# EAGLE design roaster3 (EAGLE 9.6.2)
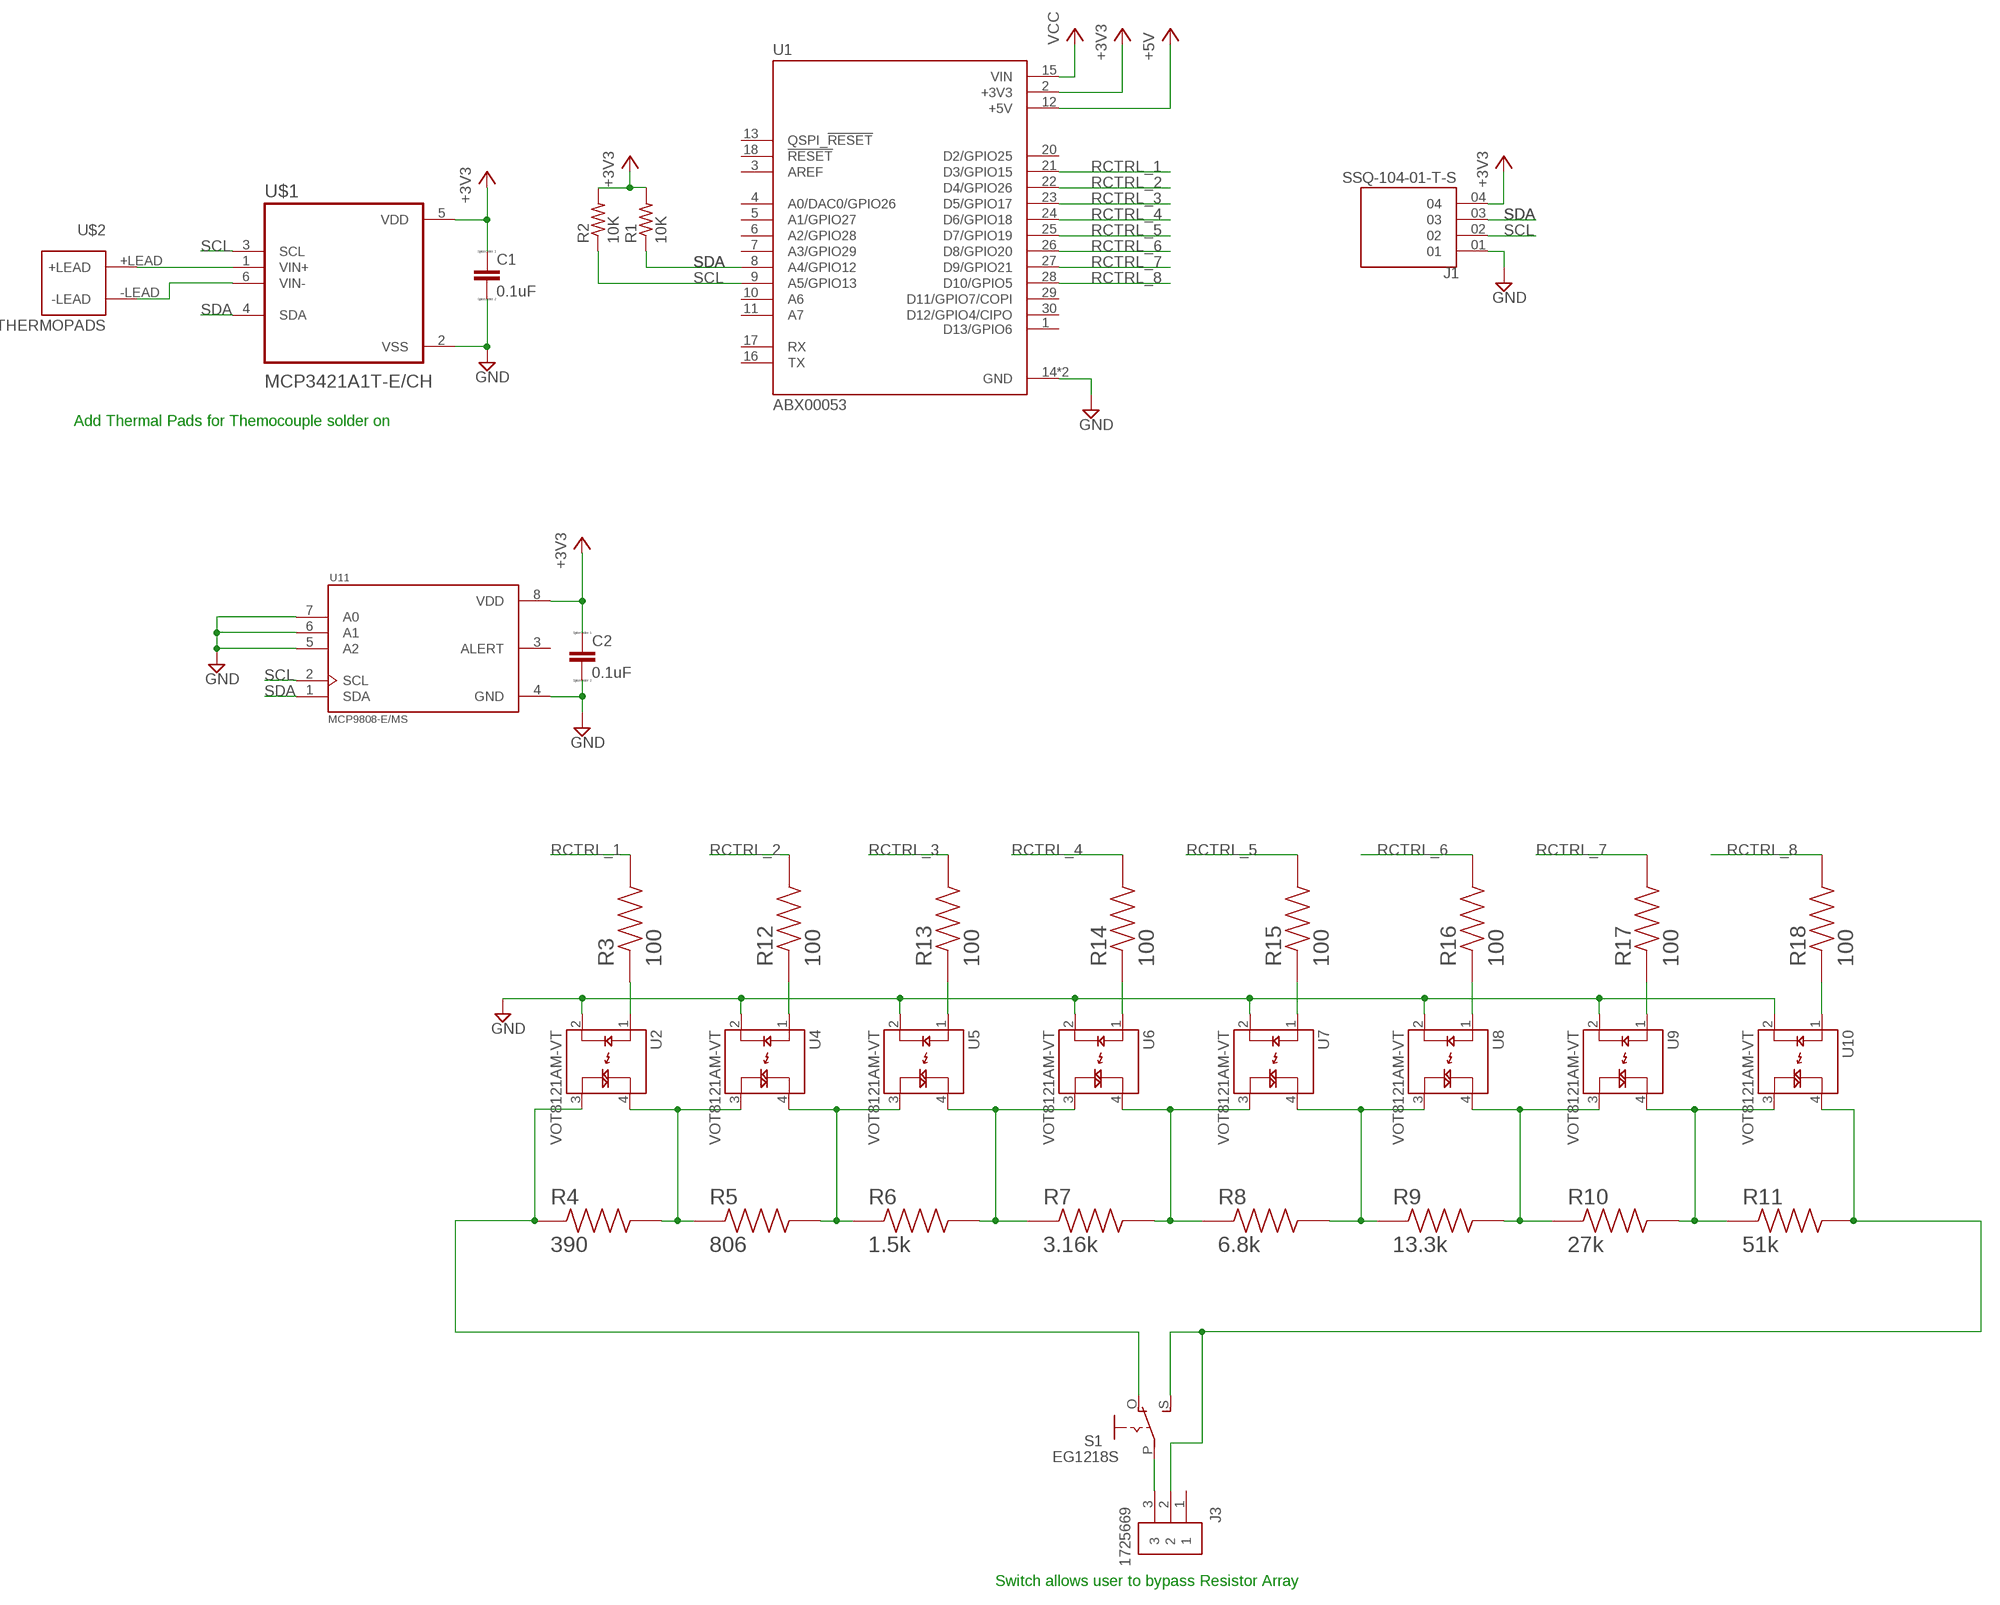
[diagram p0: schematic, sheet 1]

## Parts
C1  0.1uF  RUNJUMP_CAPACITOR-0.1UF-DECOUPLING-0603  [RUNJUMP_C0603]
C2  0.1uF  RUNJUMP_CAPACITOR-0.1UF-DECOUPLING-0603  [RUNJUMP_C0603]
J1  SSQ-104-01-T-S  [SAMTEC_SSQ-104-01-T-S]
J3  1725669  [PHOENIX_1725669]
R1  10K  RUNJUMP_RESISTOR-10K  [RUNJUMP_R0603]
R2  10K  RUNJUMP_RESISTOR-10K  [RUNJUMP_R0603]
R3  100  AC0603FR-10100RL  [RESC1608X55N]
R4  390  RMCF2512JT390R  [RESC6332X70N]
R5  806  RMCF2512FT806R  [RESC6332X70N]
R6  1.5k  RMCF2512JT1K50  [RESC6332X70N]
R7  3.16k  RMCF2512FT3K16  [RESC6332X70N]
R8  6.8k  RMCF2512JT6K80  [RESC6332X70N]
R9  13.3k  RMCF2512FT13K3  [RESC6332X70N]
R10  27k  RMCF2512JT27K0  [RESC6332X70N]
R11  51k  RMCF2512JT51K0  [RESC6332X70N]
R12  100  AC0603FR-10100RL  [RESC1608X55N]
R13  100  AC0603FR-10100RL  [RESC1608X55N]
R14  100  AC0603FR-10100RL  [RESC1608X55N]
R15  100  AC0603FR-10100RL  [RESC1608X55N]
R16  100  AC0603FR-10100RL  [RESC1608X55N]
R17  100  AC0603FR-10100RL  [RESC1608X55N]
R18  100  AC0603FR-10100RL  [RESC1608X55N]
S1  EG1218S  [EG1218]
U1  ABX00053  [MODULE_ABX00053]
U2  VOT8121AM-VT  [SOIC254P675X240-4N]
U4  VOT8121AM-VT  [SOIC254P675X240-4N]
U5  VOT8121AM-VT  [SOIC254P675X240-4N]
U6  VOT8121AM-VT  [SOIC254P675X240-4N]
U7  VOT8121AM-VT  [SOIC254P675X240-4N]
U8  VOT8121AM-VT  [SOIC254P675X240-4N]
U9  VOT8121AM-VT  [SOIC254P675X240-4N]
U10  VOT8121AM-VT  [SOIC254P675X240-4N]
U11  MCP9808-E/MS  [SOP65P490X110-8N]
U$1  MCP3421A1T-E/CH  [SOT95P280X145-6N]
U$2  THERMOPADS  [THERMOPADS]

## Nets
+3V3: C1.1 C2.1 J1.04 R1.2 R2.2 U1.2(+3V3) U11.8(VDD) U$1.5(VDD)
+5V: U1.12(+5V)
GND: C1.2 C2.2 J1.01 U1.14(GND) U1.19(GND) U2.2(C) U4.2(C) U5.2(C) U6.2(C) U7.2(C) U8.2(C) U9.2(C) U10.2(C) U11.4(GND) U11.5(A2) U11.6(A1) U11.7(A0) U$1.2(VSS)
N$1: J3.3 S1.P
N$2: U$1.6(VIN-) U$2.-LEAD
N$3: U$1.1(VIN+) U$2.+LEAD
N$4: R5.2 R6.1 U4.4(MT2) U5.3(MT1)
N$5: R4.1 S1.O U2.3(MT1)
N$6: R4.2 R5.1 U2.4(MT2) U4.3(MT1)
N$7: J3.2 R11.2 S1.S U10.4(MT2)
N$8: R6.2 R7.1 U5.4(MT2) U6.3(MT1)
N$9: R7.2 R8.1 U6.4(MT2) U7.3(MT1)
N$10: R8.2 R9.1 U7.4(MT2) U8.3(MT1)
N$11: R9.2 R10.1 U8.4(MT2) U9.3(MT1)
N$12: R10.2 R11.1 U9.4(MT2) U10.3(MT1)
N$13: R3.1 U2.1(A)
N$14: R12.1 U4.1(A)
N$15: R13.1 U5.1(A)
N$16: R14.1 U6.1(A)
N$17: R15.1 U7.1(A)
N$18: R16.1 U8.1(A)
N$19: R17.1 U9.1(A)
N$20: R18.1 U10.1(A)
RCTRL_1: R3.2 U1.21(D3/GPIO15)
RCTRL_2: R12.2 U1.22(D4/GPIO26)
RCTRL_3: R13.2 U1.23(D5/GPIO17)
RCTRL_4: R14.2 U1.24(D6/GPIO18)
RCTRL_5: R15.2 U1.25(D7/GPIO19)
RCTRL_6: R16.2 U1.26(D8/GPIO20)
RCTRL_7: R17.2 U1.27(D9/GPIO21)
RCTRL_8: R18.2 U1.28(D10/GPIO5)
SCL: J1.02 R2.1 U1.9(A5/GPIO13) U11.2(SCL) U$1.3(SCL)
SDA: J1.03 R1.1 U1.8(A4/GPIO12) U11.1(SDA) U$1.4(SDA)
VCC: U1.15(VIN)
Unconnected: J3.1 U1.1(D13/GPIO6) U1.3(AREF) U1.4(A0/DAC0/GPIO26) U1.5(A1/GPIO27) U1.6(A2/GPIO28) U1.7(A3/GPIO29) U1.10(A6) U1.11(A7) U1.13(QSPI_!RESET) U1.16(TX) U1.17(RX) U1.18(!RESET) U1.20(D2/GPIO25) U1.29(D11/GPIO7/COPI) U1.30(D12/GPIO4/CIPO) U11.3(ALERT)

## Notes on the sheet
- Add Thermal Pads for Themocouple solder on
- Switch allows user to bypass Resistor Array

## Library data of the parts
C1 C2 = 2Cortico-Gen-2-Board-v1.0:RUNJUMP_CAPACITOR: Capacitor 0805; MFR: Samsung Electro-Mechanics; MFR_PN: CL10A104KA8NNNC; PN_DIGIKEY: 1276-1857-1-ND; URL_DIGIKEY: https://www.digikey.com/product-detail/en/samsung-electro-mechanics/CL10A104KA8NNNC/1276-1857-1-ND/3889943; VOLTAGE: 25V
J1 = roasterControl:SSQ-104-01-T-S: Check availability <https://pricing.snapeda.com/parts/SSQ-104-01-T-S/Samtec%20Inc./view-part?ref=eda>; AVAILABILITY: In Stock; DESCRIPTION: SSQ - Samtec 2.54mm Square Tail Single Row Socket Strip 8.5mm Profile - Fast Stock; DIGIKEY_PN: SSQ-104-01-T-S; MF: Samtec Inc.; MP: SSQ-104-01-T-S; PACKAGE: None; PRICE: None; PURCHASE-URL: https://pricing.snapeda.com/search/part/SSQ-104-01-T-S/?ref=eda
J3 = roasterControl:1725669: 3 Position Wire to Board Terminal Block Horizontal with Board 0.100" (2.54mm) Through Hole Check availability <https://pricing.snapeda.com/parts/1725669/Phoenix%20Contact/view-part?ref=eda>; AVAILABILITY: In Stock; DESCRIPTION: 3 Position Wire to Board Terminal Block Horizontal with Board 0.100 (2.54mm) Through Hole; DIGIKEY_PN: 1725669; MF: Phoenix Contact; MP: 1725669; PACKAGE: None; PRICE: None; PURCHASE-URL: https://pricing.snapeda.com/search/part/1725669/?ref=eda
R1 R2 = 2Cortico-Gen-2-Board-v1.0:RUNJUMP_RESISTOR; MFR: Samsung Electro-Mechanics; MFR_PN: RC1608J103CS; PN_DIGIKEY: 1276-5086-1-ND; TOLERANCE: 5%; URL_DIGIKEY: https://www.digikey.com/product-detail/en/samsung-electro-mechanics/RC1608J103CS/1276-5086-1-ND/3968058
R3 R12-R18 = AC0603FR-10100RL:AC0603FR-10100RL: RES SMD 1.6M OHM 5% 1/10W 0603 Check availability <https://pricing.snapeda.com/parts/AC0603FR-10100RL/Yageo/view-part?ref=eda>; AVAILABILITY: In Stock; DESCRIPTION: 100 Ohms ±1% 0.1W, 1/10W Chip Resistor 0603 (1608 Metric) Automotive AEC-Q200 Thick Film; DIGIKEY_PN: AC0603FR-10100RL; MF: Yageo; MP: AC0603FR-10100RL; PACKAGE: None; PRICE: None; PURCHASE-URL: https://pricing.snapeda.com/search/part/AC0603FR-10100RL/?ref=eda
R4 = RMCF2512JT390R:RMCF2512JT390R: Check availability <https://pricing.snapeda.com/parts/RMCF2512JT390R/Stackpole%20Electronics%20Inc/view-part?ref=eda>; AVAILABILITY: In Stock; DESCRIPTION: 390 Ohms ±5% 1W Chip Resistor 2512 (6432 Metric) Automotive AEC-Q200 Thick Film; DIGIKEY_PN: RMCF2512JT390RCT-ND; MF: Stackpole Electronics Inc; MP: RMCF2512JT390R; PACKAGE: 6332 Stackpole; PRICE: None; PURCHASE-URL: https://pricing.snapeda.com/search/part/RMCF2512JT390R/?ref=eda
R5 = RMCF2512JT390R:RMCF2512FT806R; DIGIKEY_PN: RMCF2512FT806RCT-ND
R6 = RMCF2512JT390R:RMCF2512JT1K50: Check availability <https://pricing.snapeda.com/parts/RMCF2512JT390R/Stackpole%20Electronics%20Inc/view-part?ref=eda>; DESCRIPTION: 1.5k ohms; DIGIKEY_PN: RMCF2512JT1K50; MF: Stackpole Electronics Inc
R7 = RMCF2512JT390R:RMCF2512FT3K16: Check availability <https://pricing.snapeda.com/parts/RMCF2512JT390R/Stackpole%20Electronics%20Inc/view-part?ref=eda>; DESCRIPTION: 3.16kOhms; DIGIKEY_PN: RMCF2512FT3K16; MF: Stackpole Electronics Inc
R8 = RMCF2512JT390R:RMCF2512JT6K80: Check availability <https://pricing.snapeda.com/parts/RMCF2512JT390R/Stackpole%20Electronics%20Inc/view-part?ref=eda>; DESCRIPTION: 6.8kOhms; DIGIKEY_PN: RMCF2512JT6K80; MF: Stackpole Electronics Inc
R9 = RMCF2512JT390R:RMCF2512FT13K3: Check availability <https://pricing.snapeda.com/parts/RMCF2512JT390R/Stackpole%20Electronics%20Inc/view-part?ref=eda>; DESCRIPTION: 13.3kOhms; DIGIKEY_PN: RMCF2512FT13K3; MF: Stackpole Electronics Inc
R10 = RMCF2512JT390R:RMCF2512JT27K0: Check availability <https://pricing.snapeda.com/parts/RMCF2512JT390R/Stackpole%20Electronics%20Inc/view-part?ref=eda>; DESCRIPTION: 27kOhms; DIGIKEY_PN: RMCF2512JT27K0; MF: Stackpole Electronics Inc
R11 = RMCF2512JT390R:RMCF2512JT51K0: Check availability <https://pricing.snapeda.com/parts/RMCF2512JT390R/Stackpole%20Electronics%20Inc/view-part?ref=eda>; DESCRIPTION: 51kohms; DIGIKEY_PN: RMCF2512JT51K0; MF: Stackpole Electronics Inc
S1 = EG1218:EG1218: SLIDING SWITCH 0.1" spacing through hole, vertical SPDT slide switch http://www.ladyada.net/library/pcb/eaglelibrary.html Check availability <https://pricing.snapeda.com/parts/EG1218./E-Switch/view-part?ref=eda>; AVAILABILITY: In Stock; DESCRIPTION: SLIDE SWITCH, SPDT, 200MA; Contact Configuration:SPDT; Switch Operation:-; Switch Mounting:Through Hole; Product Range:-; Contact Current Max:-; Contact Voltage AC Max:-; Contact Voltage DC Max:-; Orientation:Vertical; DIGIKEY_PN: EG1218.; MF: E-Switch; MP: EG1218.; PACKAGE: None; PRICE: None
U1 = roasterControl:ABX00053: ARDUINO NANO RP2040 CONNECT WITH; DESCRIPTION: NINA-W102, RP2040 Arduino Nano RP2040 Connect with Headers series ARM® Cortex®-M0+ MCU 32-Bit Embedded Evaluation Board; DIGI-KEY_PART_NUMBER: 1050-ABX00053-ND; MF: Arduino; MP: ABX00053; PACKAGE: None; PURCHASE-URL: https://pricing.snapeda.com/search/part/ABX00053/?ref=eda
U2 U4-U10 = VOT8121AM-VT:VOT8121AM-VT: VOT8121AM-VT Check availability <https://pricing.snapeda.com/parts/VOT8121AM-VT/Vishay%20Semiconductor%20Opto%20Division/view-part?ref=eda>; AVAILABILITY: In Stock; DESCRIPTION: Optoisolator Triac Output 3750Vrms 1 Channel 4-SOP; DIGIKEY_PN: VOT8121AM-VT; MF: Vishay Semiconductor Opto Division; MP: VOT8121AM-VT; PACKAGE: SMD-4 Vishay Semiconductor Opto Division; PRICE: None; PURCHASE-URL: https://pricing.snapeda.com/search/part/VOT8121AM-VT/?ref=eda
U11 = MCP9808-E_MS:MCP9808-E/MS: Board Mount Temperature Sensors Silicon temp sensor with I2C interface Check availability <https://pricing.snapeda.com/parts/MCP9808-E/MS/Microchip/view-part?ref=eda>; AVAILABILITY: In Stock; DESCRIPTION: Temperature Sensor Digital, Local -40°C ~ 125°C 12 b 8-MSOP; DIGIKEY_PN: MCP9808-E/MS; MF: Microchip; MP: MCP9808-E/MS; PACKAGE: MSOP-8 Microchip; PRICE: None; PURCHASE-URL: https://pricing.snapeda.com/search/part/MCP9808-E/MS/?ref=eda
U$1 = MCP3421A1T-E_CH:MCP3421A1T-E/CH: Check availability <https://pricing.snapeda.com/parts/MCP3421A1T-E/CH/Microchip%20Technology/view-part?ref=eda>; AVAILABILITY: In Stock; DESCRIPTION: 18 Bit Analog to Digital Converter 1 Input 1 Sigma-Delta SOT-23-6; DIGIKEY_PN: MCP3421A1T-E/CH; MF: Microchip Technology; MP: MCP3421A1T-E/CH; PACKAGE: SOT-23-6 Microchip; PRICE: None; PURCHASE-URL: https://pricing.snapeda.com/search/part/MCP3421A1T-E/CH/?ref=eda
U$2 = roasterControl:THERMOPADS

## Board
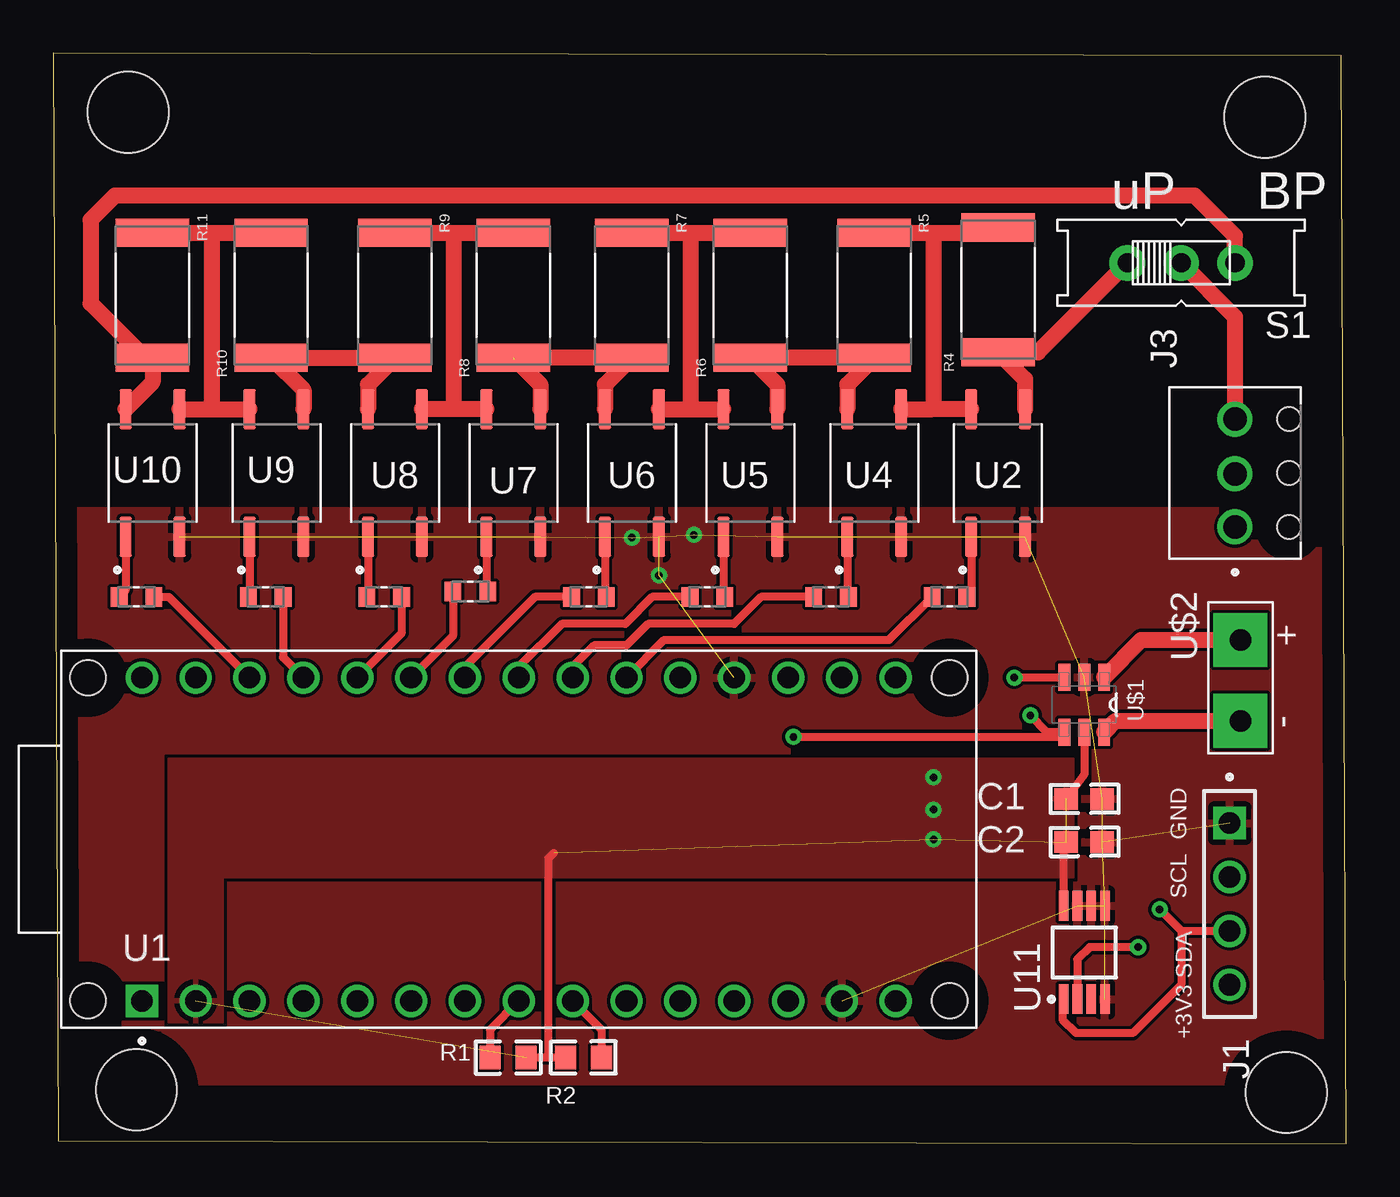
[diagram p1: board, top side]
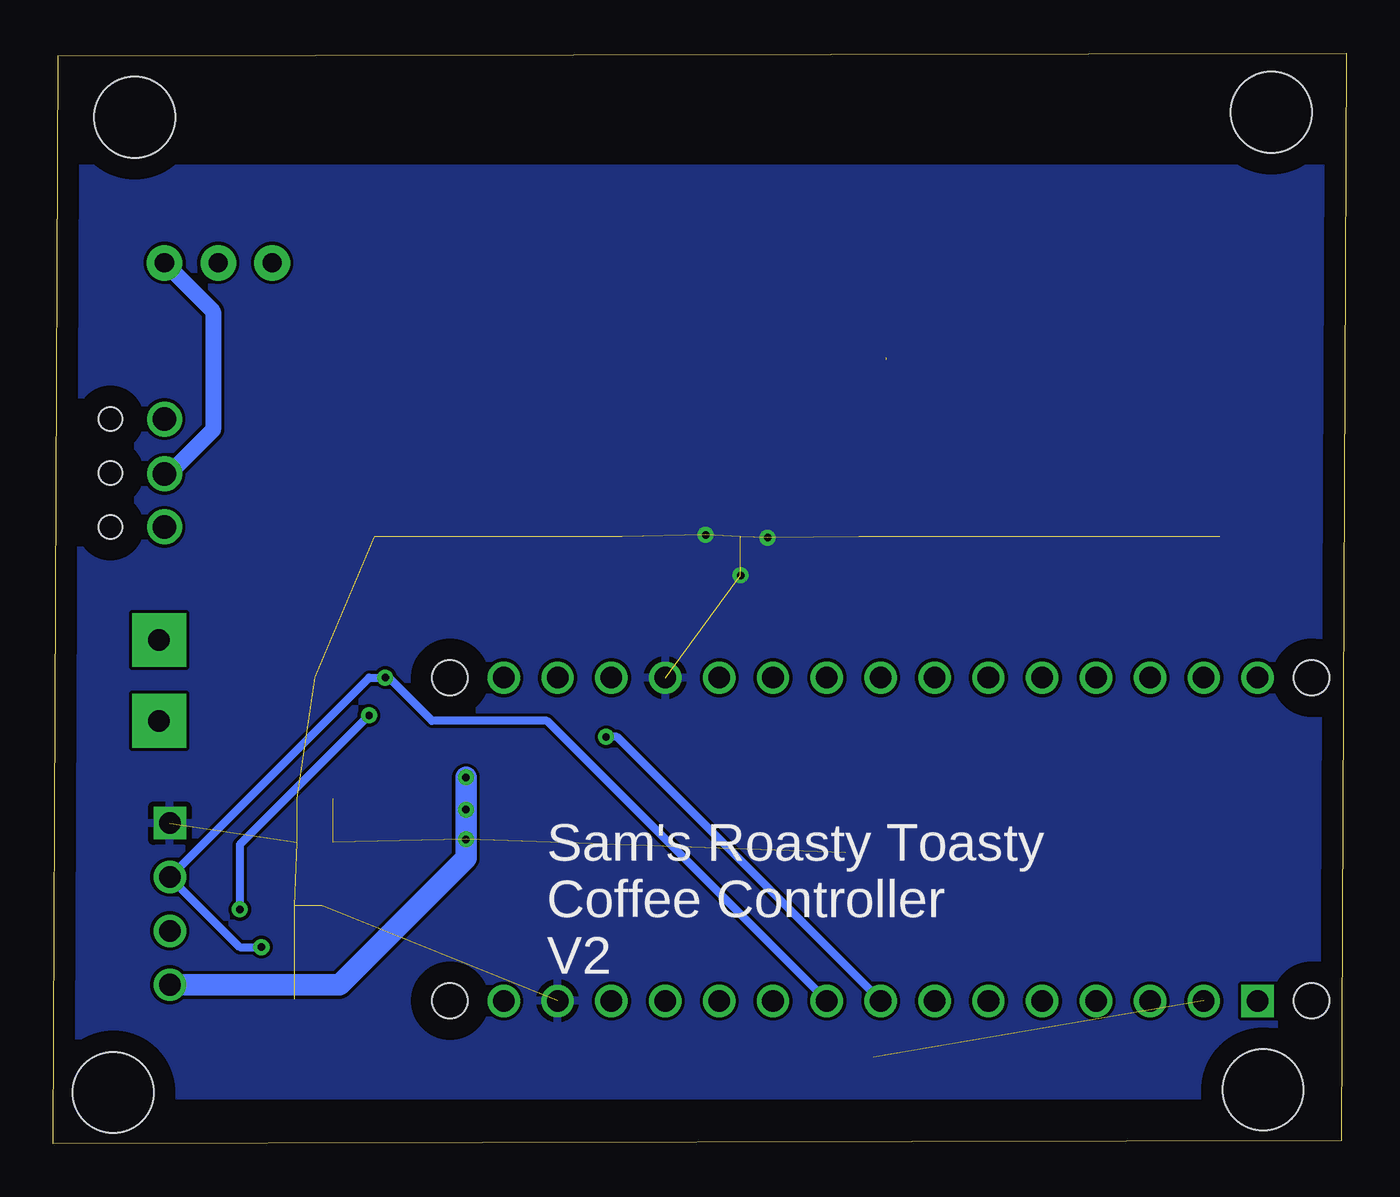
[diagram p2: board, bottom side, seen from below]

Size 61.01 x 51.43 mm. Coordinates in mm from the lower left corner, seen from the top.
Outline: 0.25,0.13 61.01,0 60.76,51.3 0,51.43 0.25,0.13
Copper layers (1*16): Top 0.035mm / dielectric 1.5mm / Bottom 0.035mm
Design rules "default": minimum track width 6mil, minimum drill 0.35mm, track to track 6mil, track to pad 6mil, pad to pad 6mil, via to via 6mil, smd to smd 6mil, copper to edge 40mil, drill to drill 6mil, minimum pad ring 10mil, minimum via ring 8mil, stop-mask expansion 4mil, vias tented up to drill 0mil, thermal gap 10mil
Holes 3.81 mm at 3.94,2.54 58.17,2.41 57.15,48.39 3.56,48.64

### Footprints (pad centres in the part's own frame; a part is rotated, then mirrored left to right if it is on the bottom)
RUNJUMP_C0603 = smd 1.1 x 1: 1 -0.85,0; 2 0.85,0
SAMTEC_SSQ-104-01-T-S = drill 1.02 pad 1.37 square: 01 -3.81,0 | drill 1.02 pad 1.37: 02 -1.27,0; 03 1.27,0; 04 3.81,0
PHOENIX_1725669 = drill 1.1: 1 -2.54,0; 2 -0.04,0; 3 2.54,0 | hole 1.1: -2.54,-2.54; 0,-2.54; 2.54,-2.54
RUNJUMP_R0603 = smd 1 x 1.1: 1 -0.85,0; 2 0.85,0
RESC1608X55N = smd 0.79 x 0.93: 1 -0.82,0; 2 0.82,0
RESC6332X70N = smd 1.33 x 3.46: 1 -2.944,0; 2 2.944,0
EG1218 = drill 0.9 pad 1.676: O -2.54,0; P 0,0; S 2.54,0
MODULE_ABX00053 = drill 1.016 square: 1 -17.78,-7.62 | drill 1.016: 2 -15.24,-7.62; 3 -12.7,-7.62; 4 -10.16,-7.62; 5 -7.62,-7.62; 6 -5.08,-7.62; 7 -2.54,-7.62; 8 0,-7.62; 9 2.54,-7.62; 10 5.08,-7.62; 11 7.62,-7.62; 12 10.16,-7.62; 13 12.7,-7.62; 14 15.24,-7.62; 15 17.78,-7.62; 16 17.78,7.62; 17 15.24,7.62; 18 12.7,7.62; 19 10.16,7.62; 20 7.62,7.62; 21 5.08,7.62; 22 2.54,7.62; 23 0,7.62; 24 -2.54,7.62; 25 -5.08,7.62; 26 -7.62,7.62; 27 -10.16,7.62; 28 -12.7,7.62; 29 -15.24,7.62; 30 -17.78,7.62 | hole 1.65: -20.32,-7.62; -20.32,7.62; 20.32,7.62; 20.32,-7.62
SOIC254P675X240-4N = smd 1.89 x 0.59: 1 -3.01,1.27; 2 -3.01,-1.27; 3 3.01,-1.27; 4 3.01,1.27
SOP65P490X110-8N = smd 1.4 x 0.45: 1 -2.2,0.975; 2 -2.2,0.325; 3 -2.2,-0.325; 4 -2.2,-0.975; 5 2.2,-0.975; 6 2.2,-0.325; 7 2.2,0.325; 8 2.2,0.975
SOT95P280X145-6N = smd 1.27 x 0.559: 1 -1.295,0.94; 2 -1.295,0; 3 -1.295,-0.94; 4 1.295,-0.94; 5 1.295,0; 6 1.295,0.94
THERMOPADS = drill 1.016 pad 2.54 square: +LEAD -1.27,0; -LEAD 2.54,0

### Placement (x,y rotation side)
C1  48.64,16.26 0 top
C2  48.64,14.22 0 top
J1  55.5,11.3 270 top
J3  55.75,31.62 90 top
R1  21.46,4.06 0 top
R2  25.02,4.06 180 top
R3  42.29,25.78 180 top
R4  44.58,40.26 90 top
R5  38.73,40.01 270 top
R6  32.89,40.01 90 top
R7  27.3,40.01 270 top
R8  21.72,40.01 90 top
R9  16.13,40.01 270 top
R10  10.29,40.01 90 top
R11  4.7,40.01 270 top
R12  36.7,25.78 180 top
R13  30.86,25.78 180 top
R14  25.27,25.78 180 top
R15  19.69,26.04 180 top
R16  15.62,25.78 0 top
R17  10.03,25.78 0 top
R18  3.94,25.78 0 top
S1  53.21,41.53 0 top
U1  21.97,14.35 0 top
U2  44.58,31.62 90 top
U4  38.73,31.62 90 top
U5  32.89,31.62 90 top
U6  27.3,31.62 90 top
U7  21.72,31.62 90 top
U8  16.13,31.62 90 top
U9  10.54,31.62 90 top
U10  4.7,31.62 90 top
U11  48.64,9.02 90 top
U$1  48.64,20.7 270 top
U$2  56.01,22.48 270 top

### Tracks (layer width: path | path; a pad name or v marks a point on that pad's centre or on a via)
+3V3  (via drill 0.35)  (4 unrouted)
  Top 0.381: U$1.5 48.64,17.4 C1.1 | C2.1 47.67,13.99 U11.8 | R1.2 23.37,4.06 | 23.37,4.06 R2.2 | 23.37,4.06 23.37,13.46 23.62,13.72
  Bottom 1.016: J1.04 47.5,7.49 41.53,13.46 v41.53,14.35 v41.53,15.75 v41.53,17.27
  pour Top: 5.46,5.71 5.46,18.16 48.13,18.16 48.13,12.57 8,12.57 8,5.71
GND  (via drill 0.35)  (20 unrouted)
  other vias: 30.23,28.7 28.58,26.8 27.3,28.57
  pour Top (rank 2): 0.51,29.84 59.94,29.84 59.94,2.92 0.64,2.92 0.51,2.79
  pour Bottom: 0.64,45.97 60.2,45.97 60.32,45.85 60.32,2.41 60.2,2.29 0.76,2.29 0.64,2.16
N$1
  Top 0.762: S1.P 55.75,38.99 J3.3
N$2
  Top 0.762: U$1.6 50.11,19.94 U$2.-LEAD
N$3
  Top 0.762: U$1.1 51.33,23.75 U$2.+LEAD
N$4
  Top 0.762: U5.3 34.16,35.79 R6.1 R5.2 37.46,35.79 U4.4
N$5
  Top 0.762: U2.3 45.85,36.05 R4.1 46.46,37.32 S1.O
N$6
  Top 0.762: R5.1 41.53,42.95 | 41.53,42.95 44.32,42.95 R4.2 | 41.53,42.95 41.53,34.67 | 41.53,34.67 41.49,34.63 U4.3 | U2.4 41.57,34.63 41.53,34.67
N$7
  Top 0.762: R11.2 4.7,36.7 | 4.7,36.7 4.7,35.9 U10.4 | 4.7,36.7 1.78,39.62 1.78,43.56 2.92,44.7 53.85,44.7 55.75,42.8 S1.S
  Bottom 0.762: S1.S 53.47,39.24 53.47,33.66 55.54,31.58 J3.2
N$8
  Top 0.762: R7.1 30.1,42.95 | 30.1,42.95 R6.2 | U6.3 30.1,34.63 | 30.1,34.63 U5.4 | 30.1,34.63 30.1,42.95
N$9  (1 unrouted)
  Top 0.762: R7.2 27.2,36.96 | 21.72,36.96 20.7,36.96 | R7.2 26.04,35.79 U6.4 | U7.3 22.99,35.79 R8.1 21.74,37.08 27.3,37.08 R7.2
N$10
  Top 0.762: R9.1 18.92,42.95 | 18.92,42.95 R8.2 | U7.4 18.92,34.63 | 18.92,34.63 U8.3 | 18.92,34.63 18.92,42.95
N$11
  Top 0.762: U8.4 14.86,35.79 R9.2 R10.1 11.81,35.54 U9.3
N$12
  Top 0.762: R11.1 7.49,42.95 | 7.49,42.95 R10.2 | U10.3 7.24,34.63 | 7.24,34.63 U9.4 | 7.49,42.95 7.49,34.89 7.24,34.63
N$13
  Top 0.381: U2.1 43.31,25.98 R3.1
N$14
  Top 0.381: U4.1 37.46,25.84 R12.1
N$15
  Top 0.381: U5.1 31.62,25.84 R13.1
N$16
  Top 0.381: U6.1 26.04,25.84 R14.1
N$17
  Top 0.381: U7.1 20.45,26.09 R15.1
N$18
  Top 0.381: U8.1 14.86,25.84 R16.1
N$19
  Top 0.381: U9.1 9.27,25.84 R17.1
N$20
  Top 0.381: U10.1 3.43,26.09 R18.1
RCTRL_1
  Top 0.381: U1.21 28.83,23.75 39.44,23.75 R3.2
RCTRL_2
  Top 0.381: R12.2 33.4,25.78 32.13,24.51 28.07,24.51 27.05,23.49 25.53,23.49 24.51,22.48 U1.22
RCTRL_3
  Top 0.381: R13.2 28.26,25.78 26.99,24.51 24,24.51 21.97,22.48 U1.23
RCTRL_4
  Top 0.381: R14.2 22.73,25.78 19.43,22.48 U1.24
RCTRL_5
  Top 0.381: R15.2 18.87,23.95 U1.25
RCTRL_6
  Top 0.381: R16.2 16.44,24.06 U1.26
RCTRL_7
  Top 0.381: R17.2 10.85,22.93 U1.27
RCTRL_8
  Top 0.381: R18.2 5.46,25.78 U1.28
SCL  (via drill 0.35)
  Top 0.381: v51.18,9.27 48.89,9.27 48.32,8.69 U11.2 | U1.9 25.87,5.37 R2.1 | v45.34,21.97 45.36,22 U$1.3
  Bottom 0.381: v51.18,9.27 52.2,9.27 J1.02 46.1,21.97 v45.34,21.97 45.16,21.97 43.13,19.94 37.72,19.94 U1.9
SDA  (via drill 0.35)
  Top 0.381: v52.2,11.05 53.21,10.03 | 53.21,10.03 J1.03 | 53.21,10.03 53.21,7.49 50.93,5.21 48.26,5.21 47.62,5.85 47.62,6.64 47.67,6.69 U11.1 | U1.8 20.61,5.37 R1.1 | v34.92,19.18 47.47,19.18 U$1.4 46.89,19.41 v46.1,20.19
  Bottom 0.381: U1.8 34.42,19.18 v34.92,19.18 | v46.1,20.19 52.2,14.1 v52.2,11.05

### Text on the board
tPlace: uP | BP | GND | SCL | SDA | +3V3
bPlace: Sam's Roasty Toasty / Coffee Controller / V2